# Altium schematic sheet TOP SHEET.SchDoc
size A3; CompanyName: MatchX; Organization: MatchX; DocumentNumber: 3; Revision: V1.0; SheetNumber: 3; SheetTotal: 9; PageSetup: Record=PageOptions|CenterHorizontal=True|CenterVertical=True|PrintScale=1.07|XCorrection=1.00|YCorrection=1.00|PrintKind=1|BorderSize=5000000|LeftOffset=0|BottomOffset=0|Orientation=2|PaperLength=1000|PaperWidth=1000|Scale=100|PaperSource=7|PrintQuality=600|MediaType=1|DitherType=10|PaperKind=A3|PrintScaleMode=1; ProjectName: mbox_SoM_V1.0
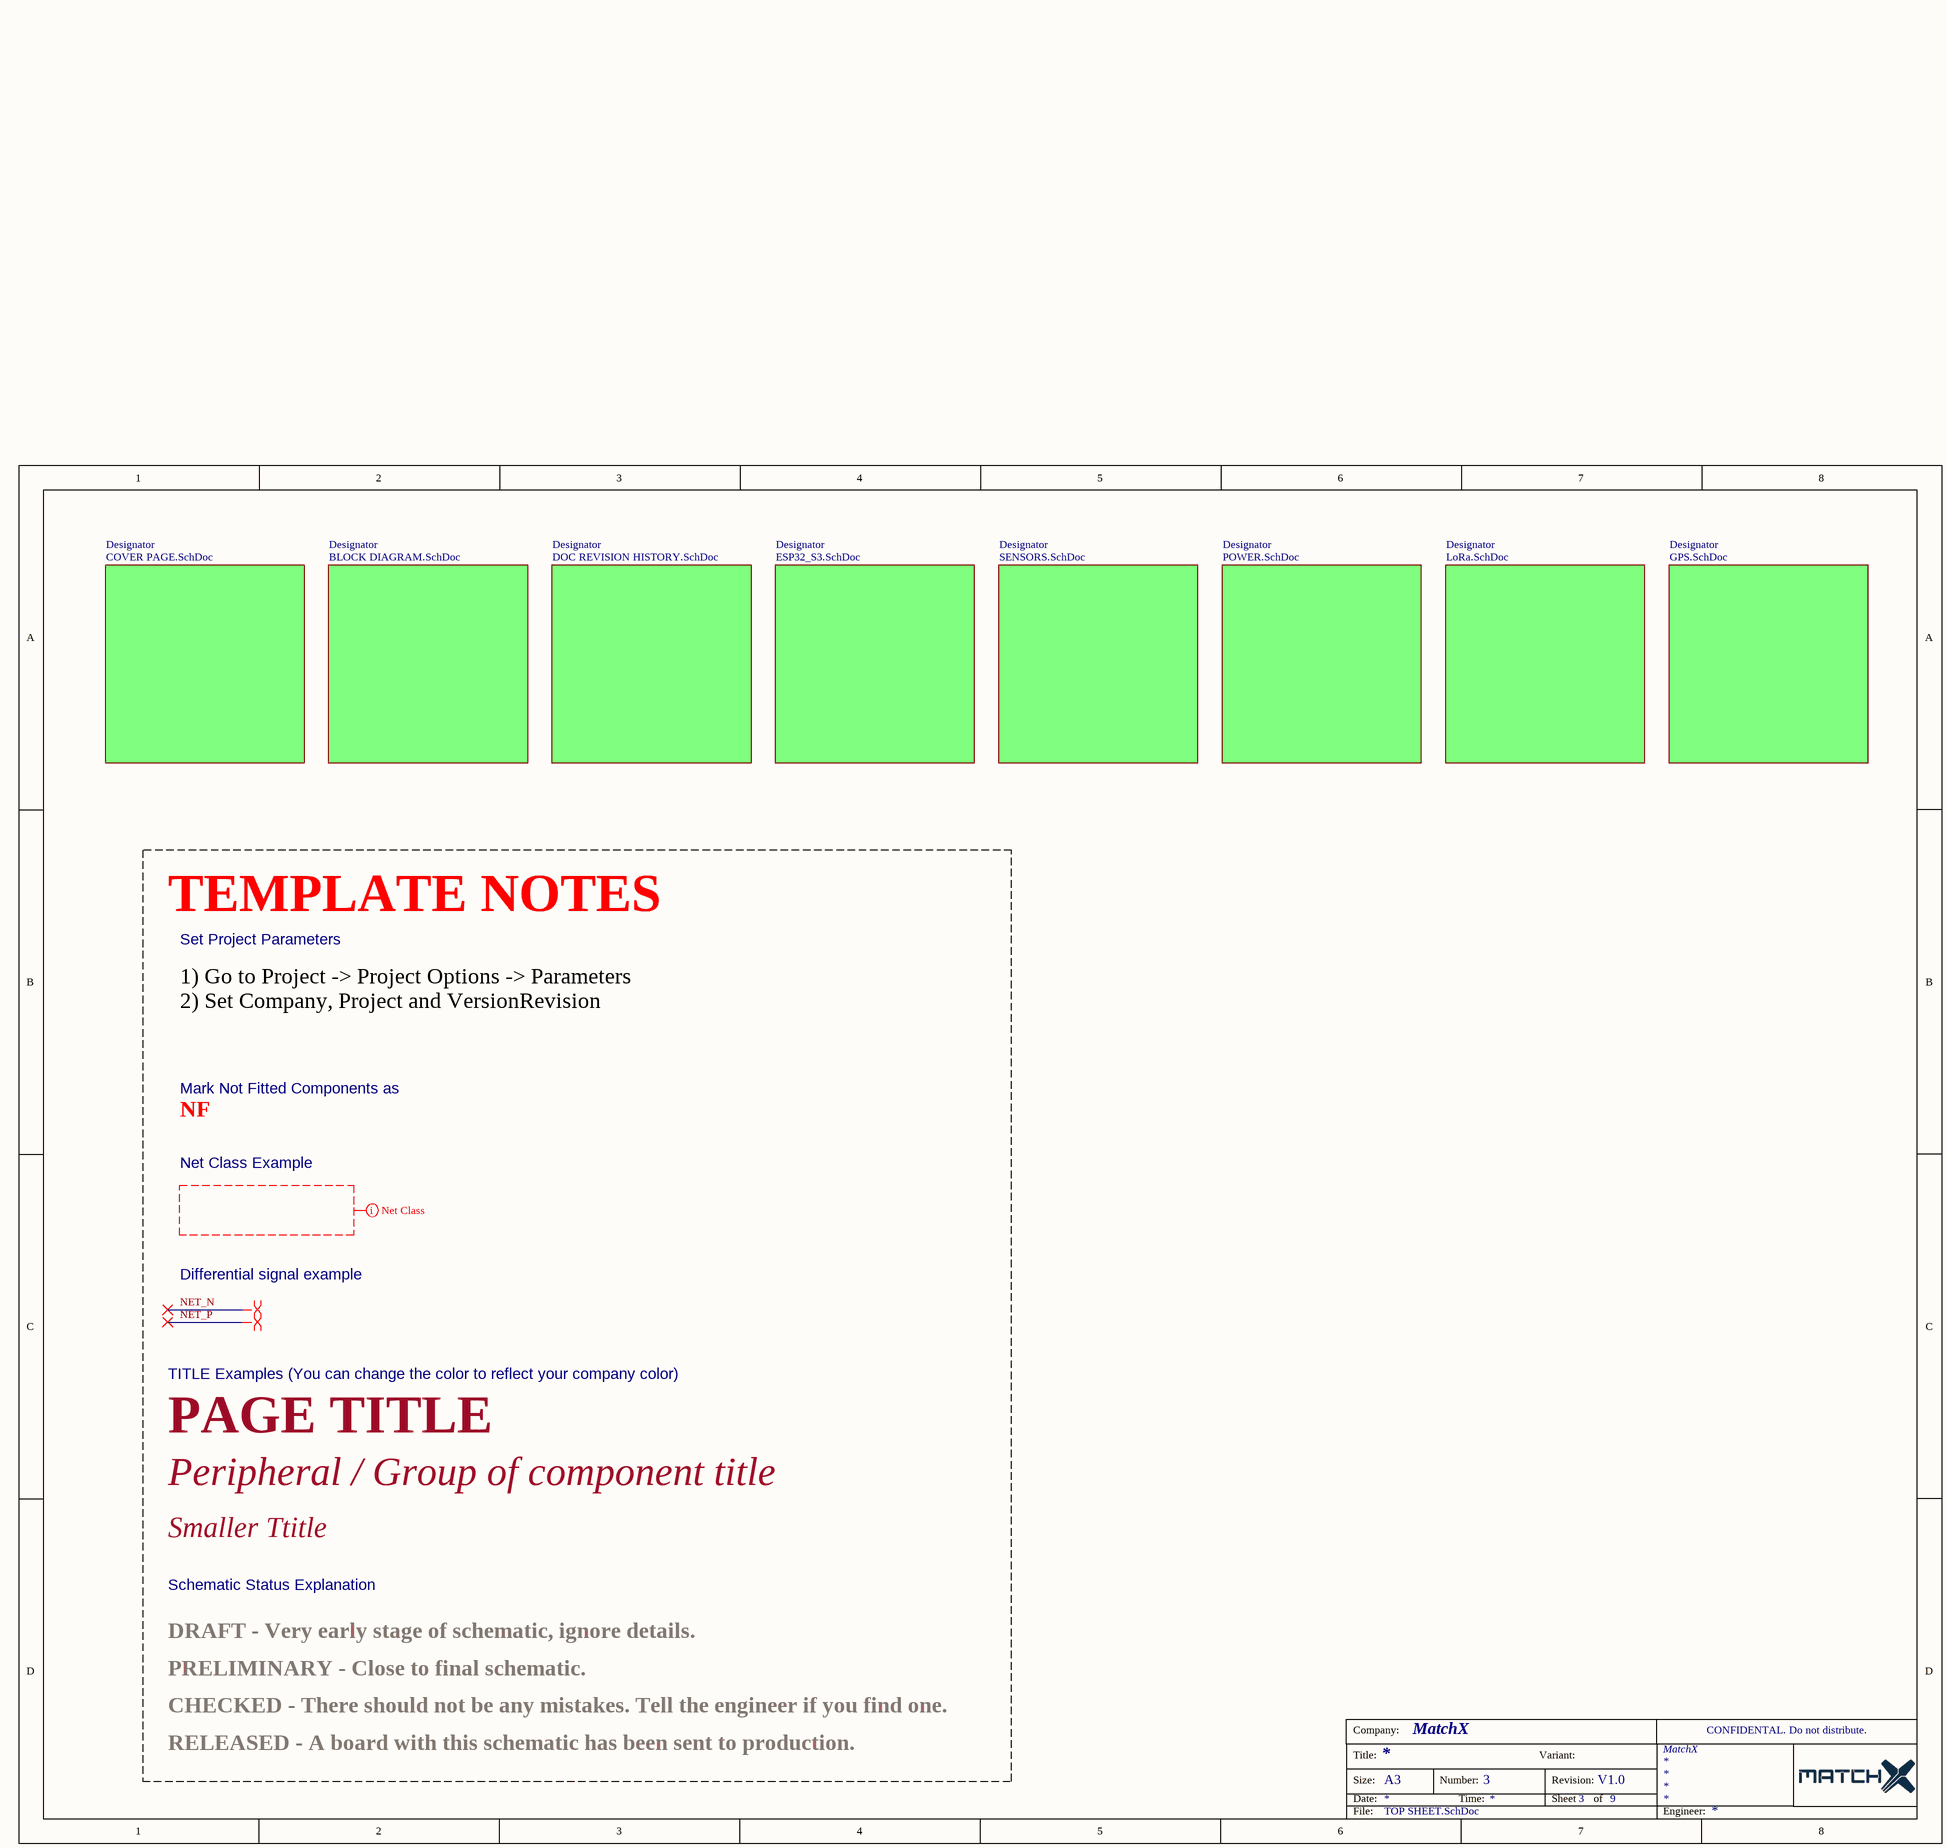
[diagram p0: TOP SHEET.SchDoc]

## Sub-sheets
Designator = COVER PAGE.SchDoc: no entries
Designator = DOC REVISION HISTORY.SchDoc: no entries
Designator = BLOCK DIAGRAM.SchDoc: no entries
Designator = ESP32_S3.SchDoc: no entries
Designator = SENSORS.SchDoc: no entries
Designator = POWER.SchDoc: no entries
Designator = LoRa.SchDoc: no entries
Designator = GPS.SchDoc: no entries

## Layout directives
differential pair: (no net found under the mark)

## Notes on the sheet
- TEMPLATE NOTES
- Set Project Parameters
- 1) Go to Project -> Project Options -> Parameters
  2) Set Company, Project and VersionRevision
- NF
- Mark Not Fitted Components as
- Net Class Example
- Differential signal example
- TITLE Examples (You can change the color to reflect your company color)
- PAGE TITLE
- Peripheral / Group of component title
- Smaller Ttitle
- Schematic Status Explanation
- PRELIMINARY - Close to final schematic.
- DRAFT - Very early stage of schematic, ignore details.
- CHECKED - There should not be any mistakes. Tell the engineer if you find one.
- RELEASED - A board with this schematic has been sent to production.
- Company:
- CONFIDENTAL. Do not distribute.
- Title:
- Size:
- Date:
- A3
- Number:
- Time:
- Variant:
- Revision:
- Sheet
- of
- File:
- Engineer: